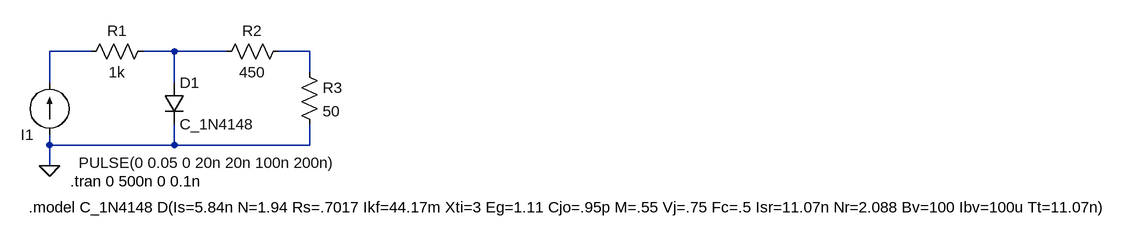
[diagram p0: schematic 1N4148_Vfr_Current.asc]
1N4148_Vfr_Current.asc, the LTspice schematic file:
Version 4.1
SHEET 1 1956 680
WIRE 128 64 64 64
WIRE 256 64 208 64
WIRE 336 64 256 64
WIRE 464 64 416 64
WIRE 464 96 464 64
WIRE 64 112 64 64
WIRE 256 112 256 64
WIRE 64 208 64 192
WIRE 256 208 256 176
WIRE 256 208 64 208
WIRE 464 208 464 176
WIRE 464 208 256 208
WIRE 64 240 64 208
FLAG 64 240 0
SYMBOL diode 240 112 R0
SYMATTR InstName D1
SYMATTR Value C_1N4148
SYMBOL res 224 48 R90
WINDOW 0 0 56 VBottom 2
WINDOW 3 32 56 VTop 2
SYMATTR InstName R1
SYMATTR Value 1k
SYMBOL res 320 80 R270
WINDOW 0 32 56 VTop 2
WINDOW 3 0 56 VBottom 2
SYMATTR InstName R2
SYMATTR Value 450
SYMBOL res 448 80 R0
SYMATTR InstName R3
SYMATTR Value 50
SYMBOL current 64 192 R180
WINDOW 3 -443 -43 Left 2
WINDOW 123 0 0 Left 0
WINDOW 39 0 0 Left 0
SYMATTR InstName I1
SYMATTR Value PULSE(0 0.05 0 20n 20n 100n 200n)
TEXT 32 304 Left 2 !.model C_1N4148 D(Is=5.84n N=1.94 Rs=.7017 Ikf=44.17m Xti=3 Eg=1.11 Cjo=.95p M=.55 Vj=.75 Fc=.5 Isr=11.07n Nr=2.088 Bv=100 Ibv=100u Tt=11.07n)
TEXT 96 264 Left 2 !.tran 0 500n 0 0.1n

The netlist it stands for:
* 1N4148_Vfr_Current.asc
D1 N002 0 C_1N4148
R1 N002 N001 1k
R2 N002 N003 450
R3 N003 0 50
I1 0 N001 PULSE(0 0.05 0 20n 20n 100n 200n)
.model D D
.lib standard.dio
.model C_1N4148 D(Is=5.84n N=1.94 Rs=.7017 Ikf=44.17m Xti=3 Eg=1.11 Cjo=.95p M=.55 Vj=.75 Fc=.5 Isr=11.07n Nr=2.088 Bv=100 Ibv=100u Tt=11.07n)
.tran 0 500n 0 0.1n
.backanno
.end